# EasyEDA Pro project Avian.epro, board PCB1
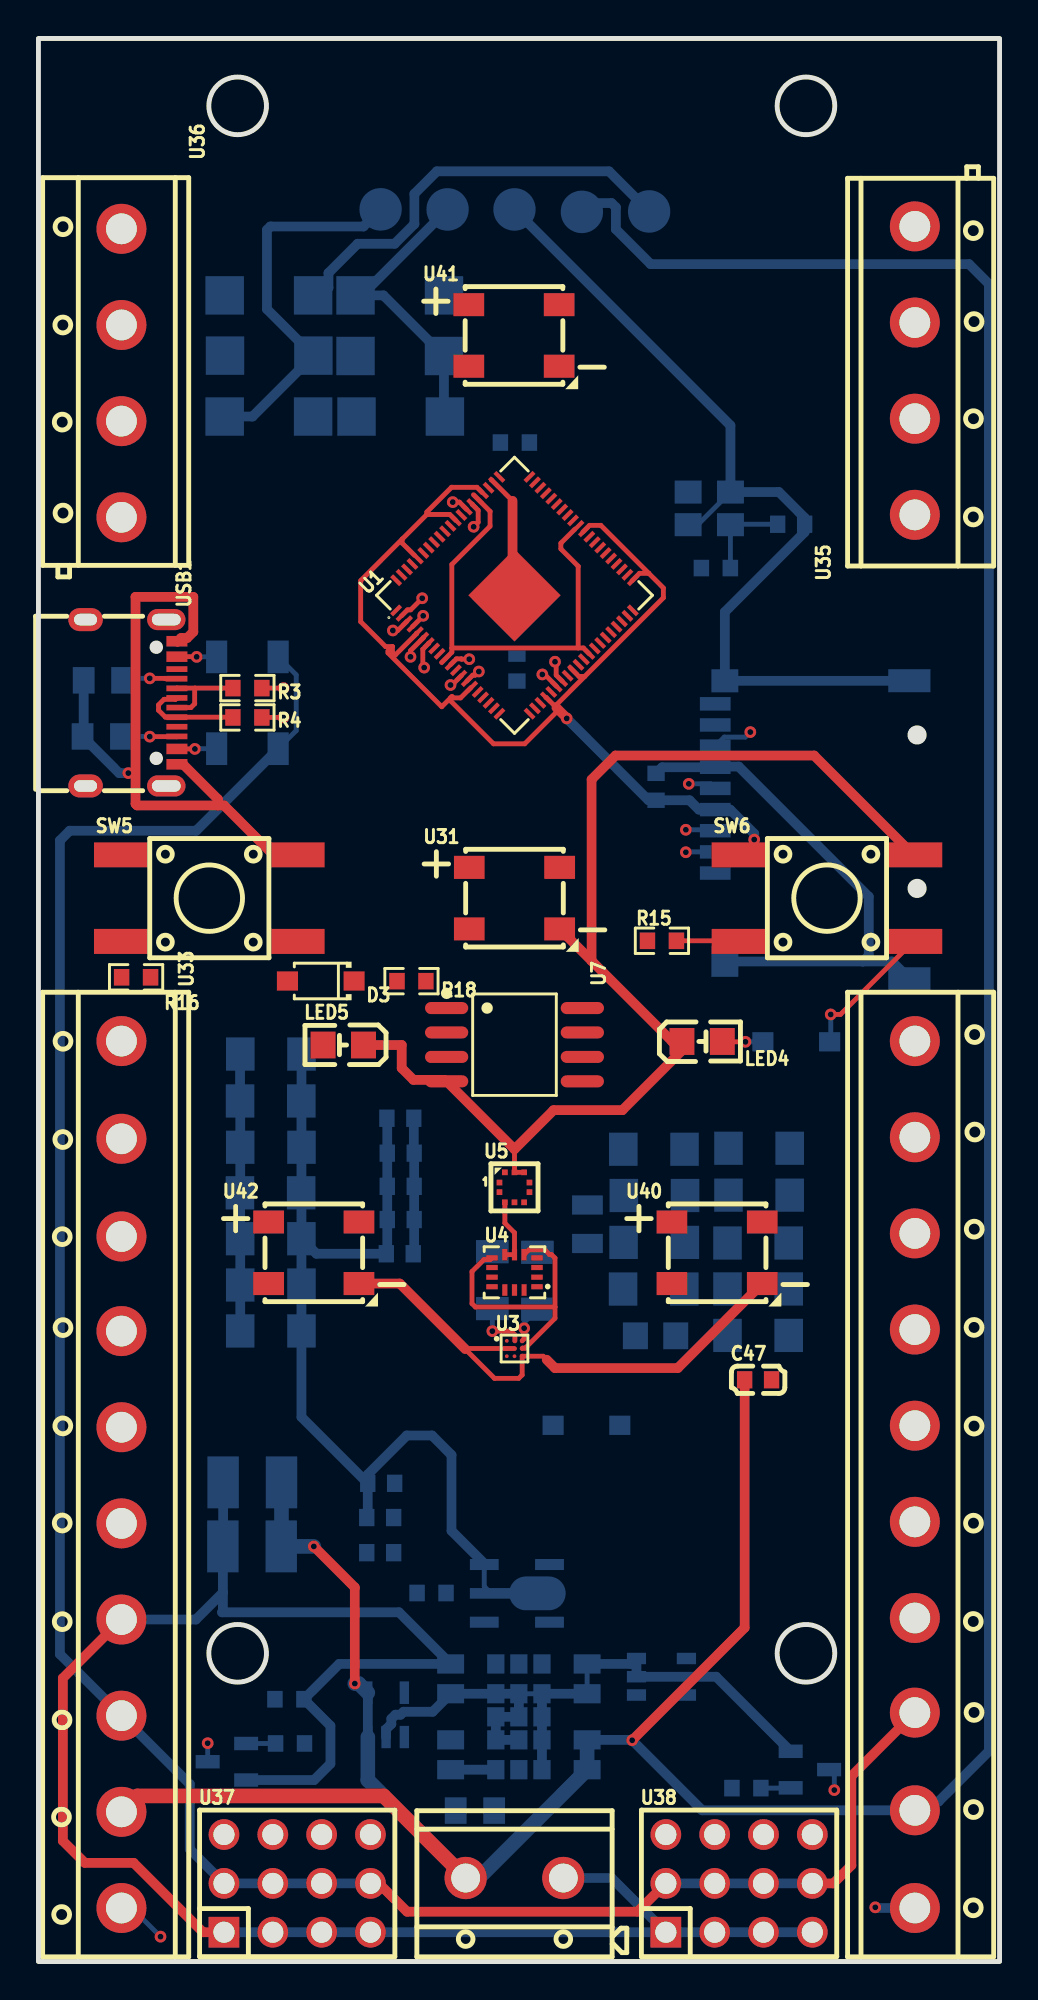
[diagram p2: board, top side]
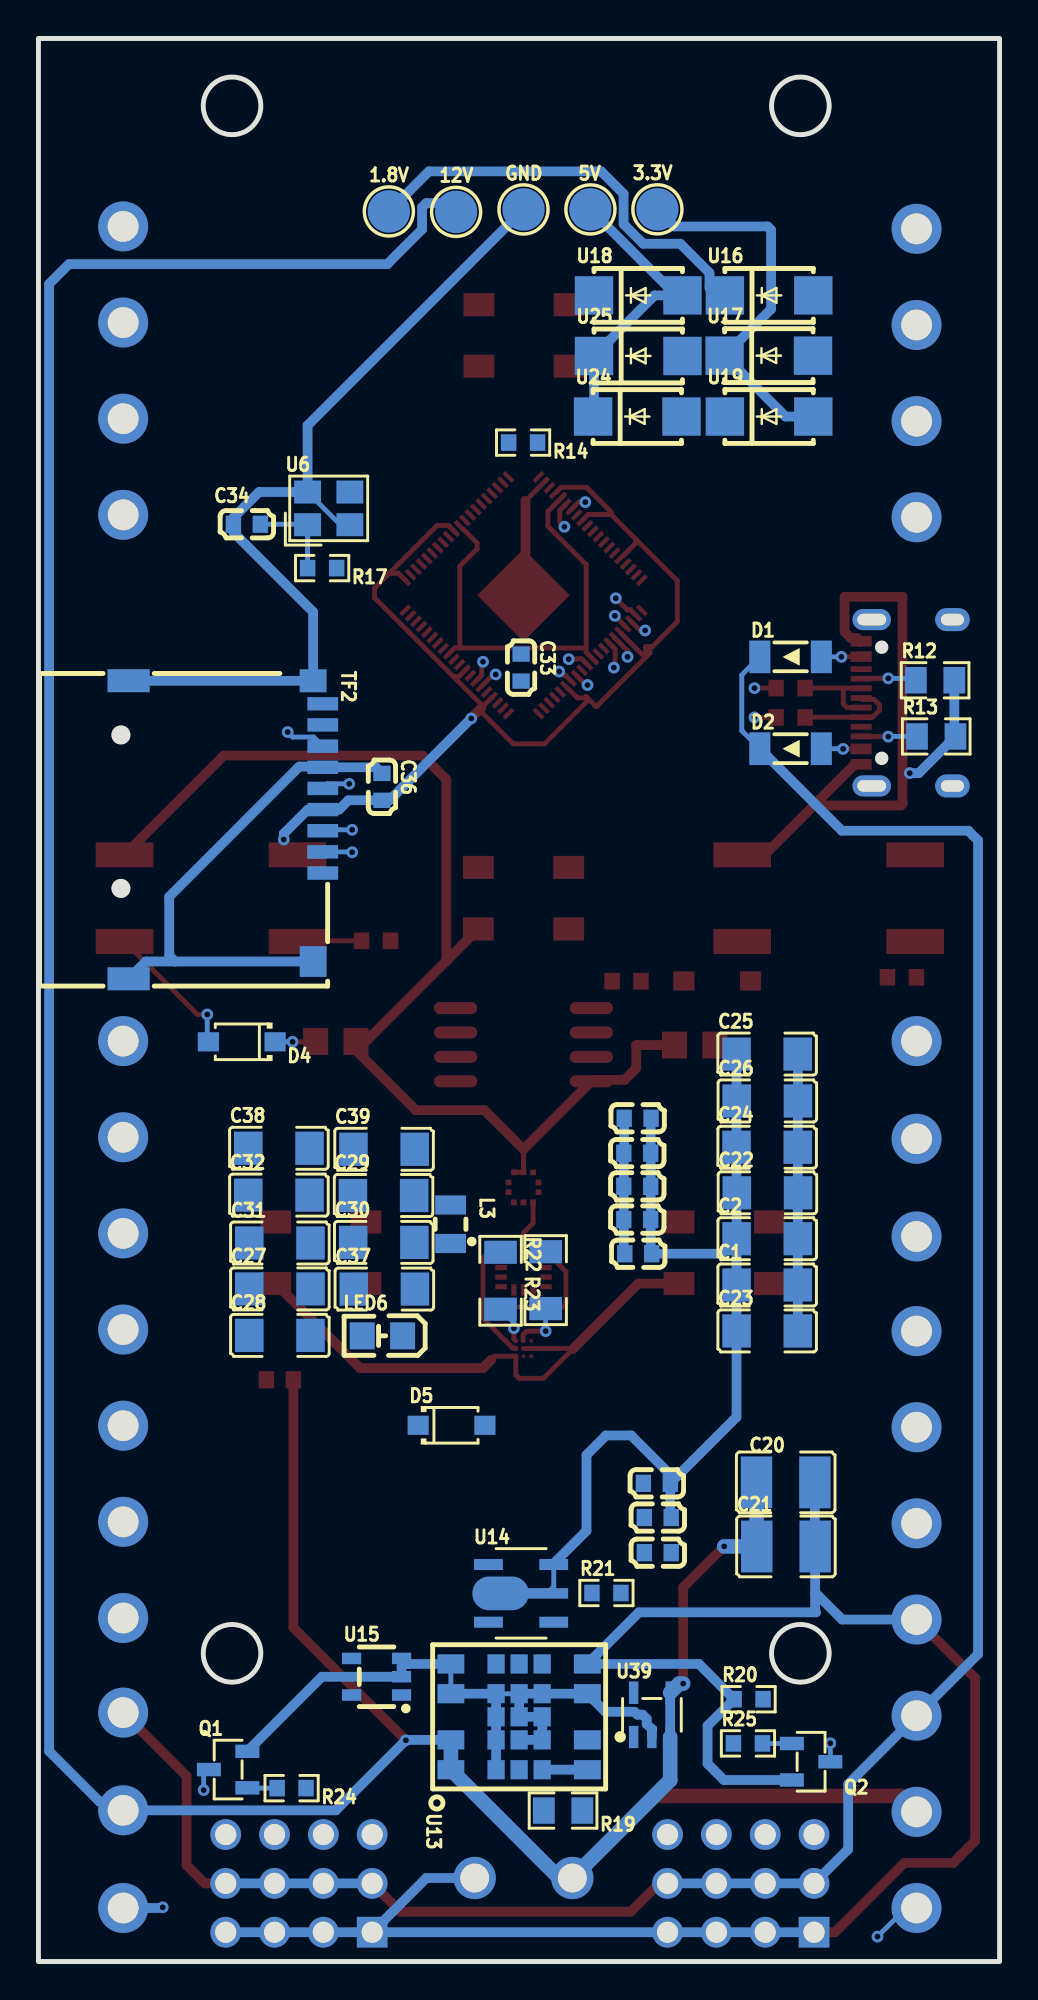
[diagram p3: board, bottom side, seen from below]

Outline 50 x 100 mm; copper layers: Top Layer, Inner1, Inner2, Bottom Layer. Coordinates in mm from the lower left corner of the outline.
Outline path: rectangle 0,100 50,0 ; circle c10.36,96.5 r1.5 ; circle c10.36,16.03 r1.5 ; circle c39.93,96.5 r1.5 ; circle c39.93,16.03 r1.5
Stack: Top Layer 0.035mm Outer layer thickness 1oz / Dielectric1 0.2104mm 7628 RC49% 8.6mil / Inner1 0.0152mm Inner layer thickness / Dielectric2 1.065mm 1.1mm H/HOZ Copper / Inner2 0.0152mm Inner layer thickness / Dielectric3 0.2104mm 7628 RC49% 8.6mil / Bottom Layer 0.035mm Outer layer thickness 1oz

## Design rules (mm)
template: JLCPCB Capability(Two Layers Board)
spacing copperThickness1oz (default): track to track 0.102, other pairs 0.152 to 0.3
spacing copperThickness2oz: track to track 0.203, other pairs 0.152 to 0.3
track width copperThickness1oz (default): min 0.127, default 0.254, max 2.54
track width copperThickness2oz: min 0.203, default 0.254, max 2.54
differential pair differentialPair (default): width min 0.127, default 0.254, max 2.54; gap min 0.152, default 0.152
via viaSize (default): diameter min 0.5, default 0.61, max 10; hole min 0.3, default 0.305, max 6.3

## Placement (name value [footprint] x y rotation side)
1.8V  90645-AS  [SMD_BD1.8-H8.0]  31.77 91.01 180 bottom
3.3V  90645-AS  [SMD_BD1.8-H8.0]  17.8 91.11 180 bottom
5V  90645-AS  [SMD_BD1.8-H8.0]  21.28 91.11 180 bottom
12V  90645-AS  [SMD_BD1.8-H8.0]  28.27 90.98 180 bottom
C1  100uF  [C1206]  12.09 35.18 180 bottom
C2  100uF  [C1206]  12.09 37.59 180 bottom
C20  22uF  [C1210]  11.12 24.92 180 bottom
C21  22uF  [C1210]  11.11 21.59 180 bottom
C22  100uF  [C1206]  12.08 39.97 180 bottom
C23  100uF  [C1206]  12.09 32.79 180 bottom
C24  100uF  [C1206]  12.09 42.34 180 bottom
C25  100uF  [C1206]  12.09 47.19 180 bottom
C26  100uF  [C1206]  12.08 44.75 180 bottom
C27  100uF  [C1206]  37.44 34.98 180 bottom
C28  100uF  [C1206]  37.44 32.56 180 bottom
C29  4.7uF  [C1206]  32.05 39.83 180 bottom
C30  4.7uF  [C1206]  32.03 37.4 180 bottom
C31  4.7uF  [C1206]  37.44 37.36 180 bottom
C32  4.7uF  [C1206]  37.49 39.85 180 bottom
C33  15pF  [C0603]  24.89 67.28 270 bottom
C34  15pF  [C0603]  39.16 74.74 180 bottom
C35  100nF  [C0603]  18.8 36.81 180 bottom
C36  100nF  [C0603]  32.13 61.09 270 bottom
C37  100uF  [C1206]  32 34.97 180 bottom
C38  100uF  [C1206]  37.49 42.29 180 bottom
C39  2.2uF  [C1206]  32.02 42.24 180 bottom
C40  10nF  [C0603]  17.78 21.26 180 bottom
C41  100nF  [C0603]  18.85 40.31 180 bottom
C42  100nF  [C0603]  18.85 38.58 0 bottom
C43  100nF  [C0603]  18.83 43.85 180 bottom
C44  100nF  [C0603]  18.85 42.04 0 bottom
C45  100nF  [C0603]  17.83 24.87 180 bottom
C46  100nF  [C0603]  17.78 23.09 0 bottom
C47  100nF  [C0603]  37.44 30.25 0 top
D1  5.6V稳压管  [LL-34_L3.5-W1.5-RD]  10.87 67.84 180 bottom
D2  5.6V稳压管  [LL-34_L3.5-W1.5-RD]  10.87 63.07 180 bottom
D3  1N4148W  [SOD-123F_L2.7-W1.6-LS3.8-RD]  14.69 50.99 180 top
D4  1N4148W  [SOD-123F_L2.7-W1.6-LS3.8-RD]  39.42 47.83 0 bottom
D5  1N4148W  [SOD-123F_L2.7-W1.6-LS3.8-RD]  28.51 27.88 180 bottom
GND  90645-AS  [SMD_BD1.8-H8.0]  24.76 91.11 180 bottom
L3  3.3uH  [IND-SMD_L2.0-W1.6_AOTA-B201610S3R3-101-T]  28.56 38.34 270 bottom
LED4  YLED0805G  [LED0805-FD-GREEN]  34.53 47.84 180 top
LED5  YLED0805G  [LED0805-FD-GREEN]  15.86 47.66 0 top
LED6  YLED0805G  [LED0805-FD-GREEN]  32.11 32.54 180 bottom
Q1  AO3400A  [SOT-23-3_L2.9-W1.3-P1.90-LS2.4-BR]  40.13 9.98 180 bottom
Q2  AO3400A  [SOT-23-3_L2.9-W1.3-P1.90-LS2.4-BR]  9.8 10.39 0 bottom
R3  261kΩ  [R0603]  10.87 66.22 0 top
R4  261kΩ  [R0603]  10.87 64.69 0 top
R12  5.1kΩ  [R0805]  3.35 66.62 180 bottom
R13  5.1kΩ  [R0805]  3.29 63.71 180 bottom
R14  33Ω  [R0603]  24.79 78.99 0 bottom
R15  1kΩ  [R0603]  32.44 53.08 180 top
R16  1kΩ  [R0603]  5.08 51.18 0 top
R17  1kΩ  [R0603]  35.24 72.46 0 bottom
R18  10kΩ  [R0603]  19.41 50.98 180 top
R19  1.2kΩ  [R0805]  22.71 7.85 0 bottom
R20  160kΩ  [R0603]  13.06 13.64 180 bottom
R21  10kΩ  [R0603]  20.45 19.16 180 bottom
R22  4.7kΩ  [R1206]  25.96 35.4 270 bottom
R23  4.7kΩ  [R1206]  23.61 35.43 270 bottom
R24  10kΩ  [R0603]  36.83 9.02 0 bottom
R25  10kΩ  [R0603]  13.09 11.34 180 bottom
SW5  KSC441G70SHLFS  [KEY--SMD_4P-L6.2-W6.2-P4.50-LS12.0]  8.89 55.3 0 top
SW6  KSC441G70SHLFS  [KEY--SMD_4P-L6.2-W6.2-P4.50-LS12.0]  41.02 55.3 0 top
TF2  TF-CARD H1.8  [TF-SMD_TF-CARD-H1.8]  40.26 58.85 270 bottom
U1  RP2350B  [QFN-80_L10.0-W10.0-P0.40-TL-EP3.4]  24.76 71.04 45 top
U3  BMM350  [WLCSP-9_L1.3-W1.3-R3-C3-P0.40-TL]  24.76 31.88 0 top
U4  BMI270  [LGA-14_L3.0-W2.5-P0.50-BR]  24.76 35.84 0 top
U5  BMP581  [LGA-10_L2.0-W2.0-P0.50-TL_BMP581]  24.76 40.26 0 top
U6  ABM8-272-T3  [CRYSTAL-SMD_4P-L3.2-W2.5-BL]  34.9 75.56 180 bottom
U7  W25Q128JVSIQ  [SOIC-8_L5.3-W5.3-P1.27-LS8.0-BL]  24.76 47.68 270 top
U13  MYMGK00506ERSR  [LGA-23_L9.0-W7.5_MYMGK00506ERSR]  24.99 12.73 90 bottom
U14  AP2112R5A-1.8TRG1  [SOT-89-5_L4.5-W2.5-P1.50-LS4.5-BR]  24.89 19.14 180 bottom
U15  AP2112K-3.3TRG1(MS)  [SOT-23-5_L2.9-W1.6-P0.95-LS2.7-BR]  32.41 14.81 180 bottom
U16  CDBA140SL-HF  [DO-214AC_L4.3-W2.7-LS5.3-RD]  11.99 86.64 180 bottom
U17  CDBA140SL-HF  [DO-214AC_L4.3-W2.7-LS5.3-RD]  12 83.51 180 bottom
U18  CDBA140SL-HF  [DO-214AC_L4.3-W2.7-LS5.3-RD]  18.8 86.64 180 bottom
U19  CDBA140SL-HF  [DO-214AC_L4.3-W2.7-LS5.3-RD]  11.99 80.34 180 bottom
U24  CDBA140SL-HF  [DO-214AC_L4.3-W2.7-LS5.3-RD]  18.85 80.34 180 bottom
U25  CDBA140SL-HF  [DO-214AC_L4.3-W2.7-LS5.3-RD]  18.8 83.49 180 bottom
U31  WS2812  [LED-SMD_4P-L5.0-W5.0-TL-A]  24.76 55.3 0 top
U32  JL301-50010U02  [CONN-TH_10P-P5.00_JL301-50010U02]  45.59 25.32 90 top
U33  JL301-50010U02  [CONN-TH_10P-P5.00_JL301-50010U02]  4.32 25.32 270 top
U34  JL301-50002U04  [CONN-TH_JL301-50002U01]  24.76 4.34 180 top
U35  JL301-50004U02  [CONN-TH_4P-P5.00_JL301-50004U02]  45.59 82.73 90 top
U36  JL301-50004U02  [CONN-TH_4P-P5.00_JL301-50004U02]  4.32 82.6 270 top
U37  HX PZ2.54-3x4P ZZ  [HDR-TH_12P-P2.54-V-M-R3-C4-S2.54]  13.46 4.06 0 top
U38  HX PZ2.54-3x4P ZZ  [HDR-TH_12P-P2.54-V-M-R3-C4-S2.54]  36.45 4.06 0 top
U39  INA180A2IDBVR  [SOT-23-5_L3.0-W1.7-P0.95-LS2.8-BL]  18.09 12.83 180 bottom
U40  WS2812  [LED-SMD_4P-L5.0-W5.0-TL-A]  35.31 36.86 0 top
U41  WS2812  [LED-SMD_4P-L5.0-W5.0-TL-A]  24.74 84.56 0 top
U42  WS2812  [LED-SMD_4P-L5.0-W5.0-TL-A]  14.33 36.86 0 top
USB1  TYPE-C 16PIN 2MD(073)  [USB-C-SMD_TYPE-C-6PIN-2MD-073]  4.83 65.46 270 top

## Footprints (pads in the part's own frame, mm; a bottom-side part is the same pattern mirrored in y, then rotated)
C0603
  rect 0.8x0.9 smd: 1(-0.7,0) 2(0.7,0)
C1206
  rect 1.485x1.728 smd: 1(-1.593,0) 2(1.593,0)
C1210
  rect 1.635x2.7 smd: 1(-1.518,0) 2(1.518,0)
CONN-TH_4P-P5.00_JL301-50004U02
  round 2.6 hole 1.6: 1(-7.5,0) 2(-2.5,0) 3(2.5,0) 4(7.5,0)
CONN-TH_10P-P5.00_JL301-50010U02
  round 2.6 hole 1.6: 1(-22.54,0) 2(-17.46,0) 3(-12.38,0) 4(-7.46,0) 5(-2.46,0) 6(2.54,0) 7(7.54,0) 8(12.54,0) 9(17.54,0) 10(22.54,0)
CONN-TH_JL301-50002U01
  round 2.2 hole 1.5: 1(-2.54,0) 2(2.54,0)
CRYSTAL-SMD_4P-L3.2-W2.5-BL
  rect 1.4x1.2 smd: 1(-1.1,-0.85) 2(1.1,-0.85) 3(1.1,0.85) 4(-1.1,0.85)
DO-214AC_L4.3-W2.7-LS5.3-RD
  rect 2x2 smd: 1(-2.3,0) 2(2.3,0)
HDR-TH_12P-P2.54-V-M-R3-C4-S2.54
  rect 1.6x1.6 hole 1.1: 1(-3.81,-2.54)
  round 1.6 hole 1.1: 2(-3.81,0) 3(-3.81,2.54) 4(-1.27,-2.54) 5(-1.27,0) 6(-1.27,2.54) 7(1.27,-2.54) 8(1.27,0) 9(1.27,2.54) 10(3.81,-2.54) 11(3.81,0) 12(3.81,2.54)
IND-SMD_L2.0-W1.6_AOTA-B201610S3R3-101-T
  rect 1x1.6 smd: 1(-1,0) 2(1,0)
KEY--SMD_4P-L6.2-W6.2-P4.50-LS12.0
  rect 3x1.3 smd: 1(-4.5,2.25) 2(4.5,2.25) 3(-4.5,-2.25) 4(4.5,-2.25)
LED0805-FD-GREEN
  rect 1.3x1.399 smd: 1(-1.05,0) 2(1.05,0)
LED-SMD_4P-L5.0-W5.0-TL-A
  rect 1.6x1.2 smd: 1(-2.35,1.6) 2(-2.35,-1.6) 3(2.35,-1.6) 4(2.35,1.6)
LGA-10_L2.0-W2.0-P0.50-TL_BMP581
  rect 0.3x0.3 smd: 1(-0.78,0.25) 2(-0.78,-0.25) 3(-0.5,-0.78) 4(0,-0.78) 5(0.5,-0.78) 6(0.78,-0.25) 7(0.78,0.25) 8(0.5,0.78) 9(0,0.78) 10(-0.5,0.78)
LGA-14_L3.0-W2.5-P0.50-BR
  rect 0.6x0.27 smd: 1(1.17,-0.75) 2(1.17,-0.25) 3(1.17,0.25) 4(1.17,0.75) 8(-1.17,0.75) 9(-1.17,0.25) 10(-1.17,-0.25) 11(-1.17,-0.75)
  rect 0.27x0.6 smd: 5(0.5,0.92) 6(0,0.92) 7(-0.5,0.92) 12(-0.5,-0.92) 13(0,-0.92) 14(0.5,-0.92)
LGA-23_L9.0-W7.5_MYMGK00506ERSR
  rect 1x1.4 smd: 1(-2.75,3.55) 2(-1.2,3.55) 6(-2.75,-3.55) 7(-1.2,-3.55) 8(1.2,-3.55) 9(2.75,-3.55) 13(2.75,3.55) 14(1.2,3.55)
  rect 1x0.9 smd: 3(-2.75,1.2) 4(-2.75,0) 5(-2.75,-1.2) 10(2.75,-1.2) 11(2.75,0) 12(2.75,1.2) 15(-1.2,1.2) 16(-1.2,0) 17(-1.2,-1.2) 18(0,1.2) 19(0,0) 20(0,-1.2) 21(1.2,1.2) 22(1.2,0) 23(1.2,-1.2)
LL-34_L3.5-W1.5-RD
  rect 1.1x1.7 smd: 1(-1.6,0) 2(1.6,0)
QFN-80_L10.0-W10.0-P0.40-TL-EP3.4
  rect 0.665x0.22 smd: 1(-4.907,3.8) 2(-4.907,3.4) 3(-4.907,3) 4(-4.907,2.6) 5(-4.907,2.2) 6(-4.907,1.8) 7(-4.907,1.4) 8(-4.907,1) 9(-4.907,0.6) 10(-4.907,0.2) 11(-4.907,-0.2) 12(-4.907,-0.6) 13(-4.907,-1) 14(-4.907,-1.4) 15(-4.907,-1.8) 16(-4.907,-2.2) 17(-4.907,-2.6) 18(-4.907,-3) 19(-4.907,-3.4) 20(-4.907,-3.8) 41(4.907,-3.8) 42(4.907,-3.4) 43(4.907,-3) 44(4.907,-2.6) 45(4.907,-2.2) 46(4.907,-1.8) 47(4.907,-1.4) 48(4.907,-1) 49(4.907,-0.6) 50(4.907,-0.2) 51(4.907,0.2) 52(4.907,0.6) 53(4.907,1) 54(4.907,1.4) 55(4.907,1.8) 56(4.907,2.2) 57(4.907,2.6) 58(4.907,3) 59(4.907,3.4) 60(4.907,3.8)
  rect 0.22x0.665 smd: 21(-3.8,-4.907) 22(-3.4,-4.907) 23(-3,-4.907) 24(-2.6,-4.907) 25(-2.2,-4.907) 26(-1.8,-4.907) 27(-1.4,-4.907) 28(-1,-4.907) 29(-0.6,-4.907) 30(-0.2,-4.907) 31(0.2,-4.907) 32(0.6,-4.907) 33(1,-4.907) 34(1.4,-4.907) 35(1.8,-4.907) 36(2.2,-4.907) 37(2.6,-4.907) 38(3,-4.907) 39(3.4,-4.907) 40(3.8,-4.907) 61(3.8,4.907) 62(3.4,4.907) 63(3,4.907) 64(2.6,4.907) 65(2.2,4.907) 66(1.8,4.907) 67(1.4,4.907) 68(1,4.907) 69(0.6,4.907) 70(0.2,4.907) 71(-0.2,4.907) 72(-0.6,4.907) 73(-1,4.907) 74(-1.4,4.907) 75(-1.8,4.907) 76(-2.2,4.907) 77(-2.6,4.907) 78(-3,4.907) 79(-3.4,4.907) 80(-3.8,4.907)
  rect 3.4x3.4 smd: 81(0,0)
R0603
  rect 0.806x0.864 smd: 1(-0.753,0) 2(0.753,0)
R0805
  rect 1.133x1.377 smd: 1(-1,0) 2(1,0)
R1206
  rect 1.208x1.701 smd: 1(-1.479,0) 2(1.479,0)
SMD_BD1.8-H8.0
  custom 2.2x2.21 smd: 1(0,0)
SOD-123F_L2.7-W1.6-LS3.8-RD
  rect 1.1x1 smd: 1(-1.735,0) 2(1.735,0)
SOIC-8_L5.3-W5.3-P1.27-LS8.0-BL
  oval 0.63x2.25 smd: 1(-1.905,-3.53) 2(-0.635,-3.53) 3(0.635,-3.53) 4(1.905,-3.53) 5(1.905,3.53) 6(0.635,3.53) 7(-0.635,3.53) 8(-1.905,3.53)
SOT-23-3_L2.9-W1.3-P1.90-LS2.4-BR
  rect 1.25x0.7 smd: 1(1,-0.95) 2(1,0.95) 3(-1,0)
SOT-23-5_L2.9-W1.6-P0.95-LS2.7-BR
  rect 1x0.6 smd: 1(1.3,-0.95) 2(1.3,0) 3(1.3,0.95) 4(-1.3,0.95) 5(-1.3,-0.95)
SOT-23-5_L3.0-W1.7-P0.95-LS2.8-BL
  rect 0.49x1.157 smd: 1(-0.95,-1.153) 2(0,-1.153) 3(0.95,-1.153)
  rect 0.49x1.175 smd: 4(0.95,1.153) 5(-0.95,1.153)
SOT-89-5_L4.5-W2.5-P1.50-LS4.5-BR
  rect 1.5x0.574 smd: 1(1.698,-1.5) 3(1.698,1.5) 4(-1.698,1.5) 5(-1.698,-1.5)
  oval 2.94x1.76 smd: 2(-1.067,0)
  rect 2.209x0.552 smd: 2(1.343,0)
TF-SMD_TF-CARD-H1.8
  rect 0.7x1.6 smd: 1(2.25,5.05) 2(1.15,5.05) 3(0.05,5.05) 4(-1.05,5.05) 5(-2.15,5.05) 6(-3.25,5.05) 7(-4.35,5.05) 8(-5.45,5.05) 9(-6.55,5.05)
  rect 1.2x1.4 smd: 10(-7.747,4.55)
  rect 1.2x2.2 smd: 11(-7.75,-5.05) 12(7.75,-5.05)
  rect 1.6x1.4 smd: 13(6.85,4.55)
USB-C-SMD_TYPE-C-6PIN-2MD-073
  rect 0.55x1.1 smd: 1(-3.2,2.375) 2(-2.4,2.375) 11(2.4,2.375) 12(3.2,2.375)
  rect 0.3x1.1 smd: 3(-1.75,2.375) 4(-1.25,2.375) 5(-0.75,2.375) 6(-0.25,2.375) 7(0.25,2.375) 8(0.75,2.375) 9(1.25,2.375) 10(1.75,2.375)
  oval 1.1x2 hole 0.6x1.5: 13(-4.325,1.825) 14(4.325,1.825)
  oval 1.2x1.8 hole 0.6x1.2: 13(-4.325,-2.375) 14(4.325,-2.375)
WLCSP-9_L1.3-W1.3-R3-C3-P0.40-TL
  round 0.2 smd: A1(-0.4,0.4) A2(0,0.4) A3(0.4,0.4) B1(-0.4,0) B2(0,0) B3(0.4,0) C1(-0.4,-0.4) C2(0,-0.4) C3(0.4,-0.4)

## Nets
As in the schematic.

Pads without a net: C38 2; TF2 1 8 9; U1 1 8 28 33 34 36 37 47 48 56 57 58 59 68; U4 2 3 9 10 11; U13 12; U14 1; U15 4; U31 2; U42 2; USB1 3 9 13 14

## Via types
v1: diameter 0.61, hole 0.305, Top Layer to Bottom Layer, 36 vias

## Routing (per net, layer and track width the routed paths; a pad name or vN(x,y) marks a point on that pad's centre or on a via; arc(x,y) is an arc through that point)
1.1V: length 24.3
  Top Layer w0.254: 28.08,68.31 28.35,68.31 28.66,68 ; 28.08,68.31 28.08,72.55 27.18,73.46 27.18,73.76 27.91,74.48 ; 28.08,68.31 21.51,68.31 ; 22.63,76.27 23.5,75.41 23.5,74.64 21.51,72.65 21.51,68.31 ; 20.98,67.55 21.51,68.08 21.51,68.31
1.8V: length 22.4
  Bottom Layer w0.508: 14.29,86.64 14.69,86.64 15.09,87.03 15.09,87.81 16.61,89.32 18.53,89.32 19.56,90.35 19.56,91.92 20.73,93.09 29.69,93.09 1.8V.1
3.3V: length 119
  Top Layer w0.254: 28.32,74.33 28.67,74.68 29.25,74.68 31.75,72.19 ; U3.B3 25.19,31.9 25.32,31.9 26.87,33.45 26.87,34.03 ; 26.95,65.2 26.41,65.74 U1.24 ; 26.95,65.2 26.95,65.35 28.42,66.83 ; 26.95,65.2 26.95,64.97 25.3,63.32 23.67,63.32 21.44,65.56 21.44,65.71 ; 26.87,34.03 22.74,34.03 22.56,34.21 22.56,35.88 23.18,36.5 23.51,36.5 U4.8 ; 26.87,34.03 26.87,36.58 26.69,36.76 26.59,36.76 26.35,37 25.51,37 U4.5 ; 31.75,72.19 32.51,71.42 32.51,70.92 28.42,66.83 ; 31.75,72.19 31.27,72.19 30.88,71.8 ; 28.42,66.83 28.12,66.83 27.68,67.27 ; 18.92,73.97 18.92,73.76 19.56,73.12 ; 18.92,73.97 20.21,75.25 ; 18.92,73.97 16.76,71.81 16.76,69.67 18.06,68.38 18.41,68.38 ; 20.21,75.25 20.21,75.38 21.49,76.66 22.81,76.66 23.08,76.39 ; 20.21,75.25 21.4,75.25 21.71,74.94 ; 18.41,68.38 18.41,68.07 18.56,67.93 19.67,69.05 19.67,69.08 ; 18.41,68.38 18.19,68.15 18.19,68.05 20.98,65.25 21.44,65.71 ; v1(37.24,58.34) 37.24,58.26 SW6.1 ; 21.44,65.71 21.51,65.78 21.59,65.71 21.96,65.71 22.49,66.24
  Top Layer w0.508: 26.95,65.2 27.48,64.67 v1(27.48,64.64)
  Bottom Layer w0.508: v1(27.48,64.64) 31.74,60.39 C36.2 33.87,60.39 34.36,59.9 TF2.4 35.98,59.9 37.24,58.65 v1(37.24,58.34) ; C43.1 19.53,42.06 C44.2 C41.1 C42.2 19.55,36.86 C35.1 ; U19.2 11.14,80.34 U17.1 11.89,85.92 11.89,90.04 12.07,90.22 16.91,90.22 3.3V.1 ; C25.2 10.49,47.18 C26.2 10.5,44.74 C24.2 10.5,39.99 C22.2 10.5,39.96 C2.2 10.5,37.58 C1.2 C23.2
+5V: length 135.6
  Top Layer w0.508: U37.11 17.7,4.06 19.18,2.59 31.17,2.59 U38.2 ; U38.11 41.35,4.06 42.29,5 42.29,9.64 U32.3
  Bottom Layer w0.254: D2.1 13.41,64.01 13.41,66.9 D1.1
  Bottom Layer w0.508: U37.11 U37.8 U37.5 U37.2 7.87,5.84 7.87,9.23 U33.8 1.12,15.98 1.12,58.29 1.63,58.8 8.2,58.8 D2.1 ; U24.1 21.1,80.39 U25.1 17.95,86.64 16.81,86.64 ; U38.2 U38.5 U38.8 U38.11 ; 5V.1 16.81,86.64 ; 16.81,86.64 U18.2
GND: length 399.2
  Top Layer w0.254: 24.66,75.95 23.58,77.04 23.56,77.04 ; U4.7 U4.6 24.76,37.9 24.26,38.4 U5.3 ; 26.44,31.29 26.26,31.48 U3.C3 25.16,30.51 24.99,30.33 23.72,30.33 22.2,31.85 22.23,31.88 U3.B1 U3.B2 ; U5.8 U5.9 24.76,42.24
  Top Layer w0.508: 9.34,60.12 9.34,60.44 7.52,62.26 USB1.12 ; 9.34,60.12 5.14,60.12 5.05,60.2 5.05,70.96 8.06,70.96 8.06,69.14 7.74,68.83 7.42,68.83 7.23,68.63 USB1.1 ; 9.34,60.12 9.66,60.12 12.23,57.55 SW5.2 ; U33.7 1.27,14.74 1.27,6.27 2.41,5.13 4.95,5.13 8.56,1.52 U37.1 ; SW6.2 40.35,62.71 30.02,62.71 28.78,61.47 28.78,52.03 ; 22.2,31.85 18.79,35.26 U42.3 ; 24.51,71.04 24.66,71.2 24.66,75.95 ; U40.3 33.26,30.86 26.87,30.86 26.44,31.29 ; 28.78,52.03 32.97,47.84 LED4.2 33.48,47.37 30.38,44.27 26.8,44.27 24.76,42.24 21.24,45.77 ; 28.78,52.03 27.12,53.7 ; 16.91,47.66 18.9,47.66 18.9,46.46 19.51,45.85 21.16,45.85
  Bottom Layer w0.254: 36,76.42 34.3,74.72 U6.2 ; U13.22 U13.21 ; U13.13 U13.14 ; U14.2 23.19,19.5 U14.3
  Bottom Layer w0.508: C2.1 14.46,36.81 C35.2 18.15,36.86 C42.1 C41.2 C44.1 18.15,43.83 C43.2 ; C2.1 13.68,39.96 C22.1 13.68,39.99 C24.1 13.68,44.74 C26.1 13.69,44.76 C25.1 ; C2.1 13.68,35.18 C1.1 C23.1 13.68,28.31 C45.2 ; U33.7 8.19,17.78 9.6,19.19 ; U38.1 29.82,4.34 U34.1 ; U38.1 U38.4 U38.7 U38.10 ; U38.1 U37.10 U37.7 U37.4 U37.1 ; U13.16 U13.17 U13.20 U13.19 U13.22 U13.23 U13.8 20.51,12.99 18.99,12.99 18.84,12.84 18.57,12.84 18.36,12.62 18.36,12.35 18.09,12.08 U39.2 ; Q1.2 35.26,14.81 U15.2 U15.3 30.83,15.48 U13.13 ; GND.1 36,79.88 36,76.42 38.52,76.42 39.86,75.08 C34.1 39.86,74.33 35.71,70.18 TF2.10 45.31,66.6 TF2.11 ; 42.89,52 44.41,52 TF2.12 ; 42.89,52 TF2.13 ; 42.89,52 43.2,52.31 43.2,55.37 36.43,62.14 35.25,62.14 TF2.6 32.45,62.1 C36.1 ; U14.3 23.19,20.69 21.49,22.4 21.49,26.34 20.47,27.36 19.16,27.36 17.13,25.32 C45.2 ; Q2.2 14.34,9.44 15.19,10.29 15.19,12.26 R20.1 15.64,15.48 U13.9 18.76,18.16 9.55,18.16 9.6,18.2 9.6,19.19 ; 9.6,19.19 C21.2 9.61,21.6 C20.2 ; U13.3 U13.15 U13.18 U13.21 U13.14 ; C46.1 17.13,23.14 C45.2 ; R12.2 2.35,63.76 R13.2 4.2,61.8 v1(4.67,61.8)
VCC: length 200.8
  Top Layer w0.508: v1(30.89,11.51) 36.74,17.36 C47.1 ; v1(16.46,14.45) 16.46,19.45 v1(14.33,21.59)
  Top Layer w0.762: U34.2 17.96,8.61 5.14,8.61 U33.9
  Bottom Layer w0.508: U13.2 30.87,11.53 v1(30.89,11.51) 34.53,7.86 U32.2 46.05,8.32 46.83,8.32 49.45,10.94 49.45,87.23 48.41,88.27 31.85,88.27 30.04,90.08 30.04,91.22 29.82,91.44 28.73,91.44 12V.1 ; U39.4 U39.3
  Bottom Layer w0.762: U13.2 U13.1 22.91,4.34 U34.2 17.13,9.43 U39.3 ; v1(16.46,14.45) 16.66,14.45 U39.4 ; C20.1 12.64,21.6 C21.1 v1(14.33,21.59)
CLK: length 16.8
  Top Layer w0.254: v1(21.44,66.38) 21.51,66.38 U1.13
  Inner1 w0.254: v1(21.44,66.38) 22.3,65.52 28.64,65.52 32.92,61.24 v1(33.83,61.24)
  Bottom Layer w0.254: TF2.5 34.97,61.24 v1(33.83,61.24)
GPIO6: length 27.7
  Top Layer w0.254: U1.3 18.69,69.22 v1(18.44,69.22)
  Inner2 w0.254: U36.1 18.44,75.98 v1(18.44,69.22)
GPIO7: length 25.7
  Top Layer w0.254: U1.4 20.01,69.97 v1(20.01,69.98)
  Inner2 w0.254: v1(20.01,69.98) 19.44,69.98 19.02,69.56 19.02,68.97 18.68,68.63 18.2,68.63 4.32,82.51 U36.2
GPIO8: length 21.4
  Top Layer w0.254: U1.6 20.02,68.83 19.35,68.16 v1(19.35,67.84)
  Inner2 w0.254: v1(19.35,67.84) 16.58,67.84 U36.3
GPIO9: length 21
  Top Layer w0.254: v1(20.07,67.28) 20,67.36 20,68.24 20.31,68.55 U1.7
  Inner2 w0.254: v1(20.07,67.28) 19.41,66.62 15.49,66.62 7.02,75.1 U36.4
GPIO25: length 28
  Top Layer w0.254: 26.96,66.3 26.33,66.93 v1(26.21,66.93)
  Inner2 w0.254: v1(26.21,66.93) 27.29,66.93 U35.3
GPIO26: length 31.6
  Top Layer w0.254: 27.25,66.58 26.94,66.89 26.94,67.53 v1(26.87,67.59)
  Inner2 w0.254: U35.4 26.87,71.51 v1(26.87,67.59)
MISO: length 20
  Top Layer w0.254: v1(22.41,67.72) 22.01,67.72 21.99,67.74 21.75,67.74 U1.11
  Inner1 w0.254: v1(37.03,63.93) 32.51,68.45 23.14,68.45 v1(22.41,67.72)
  Bottom Layer w0.254: v1(37.03,63.93) 36.77,63.67 35.68,63.67 TF2.7
MOSI: length 16.6
  Top Layer w0.254: U1.14 22.59,66.89 22.72,66.89 v1(22.91,67.08)
  Inner2 w0.254: v1(22.91,67.08) 31.14,58.85 v1(33.68,58.85)
  Bottom Layer w0.254: v1(33.68,58.85) 35.16,58.85 TF2.3
RPD+: length 5.4
  Top Layer w0.254: R4.1 10.11,64.71 USB1.8 6.61,64.71 6.25,65.06 6.25,65.35 6.54,65.64 7.13,65.64 USB1.6
RPD-: length 4.7
  Top Layer w0.254: USB1.7 7.93,65.21 8.13,65.41 8.13,66.21 8.14,66.22 ; 8.14,66.22 R3.1 ; 8.14,66.22 7.21,66.22 USB1.5
SDCS: length 25.2
  Top Layer w0.254: U1.2 19.2,70.29 19.36,70.29 v1(19.96,70.89)
  Inner2 w0.254: v1(33.68,57.68) 33.38,57.99 27.79,57.99 20.73,65.05 20.73,70.13 v1(19.96,70.89)
  Bottom Layer w0.254: v1(33.68,57.68) 33.7,57.7 TF2.2
$3N2422: length 2.3
  Bottom Layer w0.508: U13.5 U13.6
$3N4404: length 2
  Top Layer w0.254: v1(25.27,32.93) 25.27,32.38 25.16,32.28
  Bottom Layer w0.254: v1(25.27,32.93) 25.27,33.23 R22.2
$3N4443: length 2.7
  Top Layer w0.254: 24.79,32.28 24.79,32.59 24.59,32.78 v1(23.61,32.78)
  Bottom Layer w0.254: R23.2 v1(23.61,32.78)
$3N10357: length 1.6
  Bottom Layer w0.254: Q1.1 39.12,9.02 R24.2
$3N13570: length 14.7
  Inner1 w0.254: v1(6.35,1.3) 6.35,8.9 v1(8.8,11.35)
  Bottom Layer w0.254: v1(6.35,1.3) 4.86,2.78 U33.10 ; Q2.3 v1(8.8,11.35)
$3N13572: length 1.5
  Bottom Layer w0.254: Q2.1 12.33,11.34 R25.2
$3N13582: length 10.2
  Inner1 w0.508: v1(43.54,2.82) 41.55,4.8 41.55,8.76 v1(41.4,8.92)
  Bottom Layer w0.254: v1(41.4,8.92) 41.4,9.71 Q1.3
  Bottom Layer w0.508: v1(43.54,2.82) 43.57,2.78 U32.1
$5N665: length 2.1
  Top Layer w0.254: USB1.2 8.22,67.86 v1(8.23,67.84)
  Bottom Layer w0.254: 9.27,67.84 v1(8.23,67.84)
$5N667: length 2
  Top Layer w0.254: USB1.11 v1(8.14,63.06)
  Bottom Layer w0.254: 9.27,63.07 8.18,63.07
$5N714: length 15.9
  Top Layer w0.254: v1(22.64,74.61) 22.88,74.84 22.88,75.46 22.57,75.77 22.57,75.79 ; R3.2 v1(12.75,66.22)
  Inner1 w0.254: v1(12.75,66.22) 14.26,66.22 22.64,74.6 v1(22.64,74.61)
$5N753: length 19
  Top Layer w0.254: R4.2 v1(12.75,64.69) ; U1.67 21.9,75.89 v1(21.55,75.89)
  Inner1 w0.254: v1(12.75,64.69) 11.63,65.82 11.63,68.07 19.44,75.89 v1(21.55,75.89)
$5N865: length 2.9
  Top Layer w0.254: USB1.4 6.61,66.71 6.59,66.73 v1(5.79,66.73)
  Bottom Layer w0.254: R12.1 4.45,66.73 v1(5.79,66.73)
$5N907: length 2.9
  Top Layer w0.254: v1(5.79,63.69) 7.19,63.69 USB1.10
  Bottom Layer w0.254: 5.74,63.68 5.71,63.71 R13.1
$5N4153: length 2.1
  Top Layer w0.254: v1(36.78,47.83) 35.6,47.83 LED4.1
  Bottom Layer w0.254: D4.1 v1(36.78,47.83)
$5N4916: length 4.7
  Bottom Layer w0.254: R17.2 36,72.46 U6.1 36.02,74.74 C34.2
$5N12881: length 3.3
  Top Layer w0.254: R15.1 36.49,53.08 SW6.3
$5N12933: length 7.3
  Top Layer w0.254: v1(41.22,49.25) 41.72,49.25 SW6.4
  Bottom Layer w0.254: D4.2 41.22,47.89 v1(41.22,49.25)
